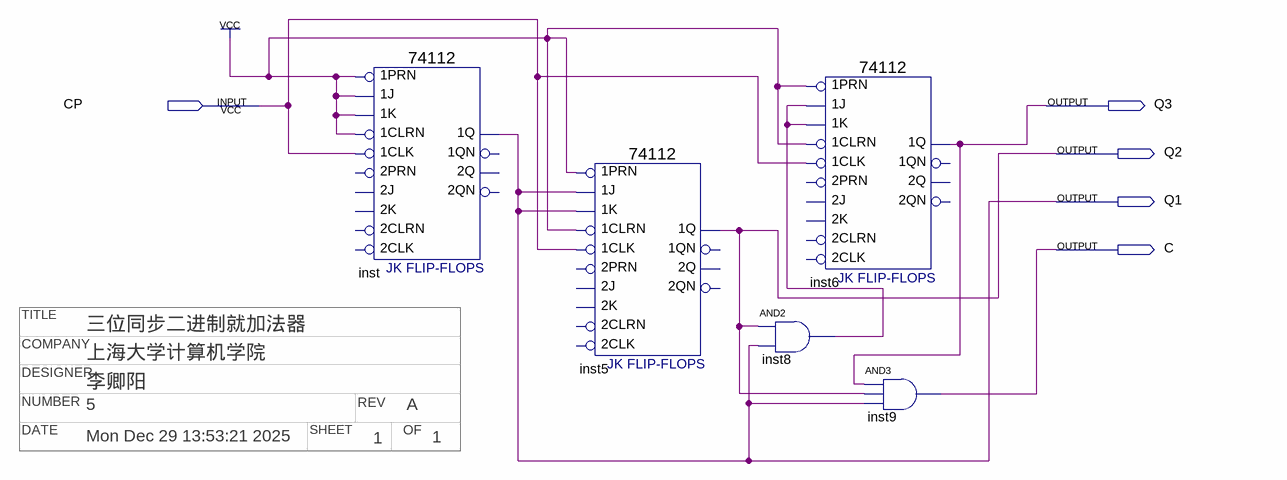
[diagram p0: schematic sheet]
// Quartus schematic sikao1.bdf as structural Verilog: 5 symbols, 5 pins
// Title block: TITLE: 三位同步二进制就加法器; COMPANY: 上海大学计算机学院; DESIGNER: 李卿阳; NUMBER: 5; REV: A; DATE: Mon Dec 29 13:53:21 2025; SHEET: 1; OF: 1
module sikao1 (
  input  CP,
  output Q3,
  output Q2,
  output Q1,
  output C
);

  wire inst8_out;

  \74112  inst (
    .\1K (1'b1), .\1J (1'b1), .\1PRN (1'b1), .\1CLK (CP), .\1CLRN (1'b1), .\1Q (Q1));  // open: 2K, 2J, 2PRN, 2CLK, 2CLRN, 1QN, 2Q, 2QN
  \74112  inst5 (
    .\1K (Q1), .\1J (Q1), .\1PRN (1'b1), .\1CLK (CP), .\1CLRN (1'b1), .\1Q (Q2));  // open: 2K, 2J, 2PRN, 2CLK, 2CLRN, 1QN, 2Q, 2QN
  and inst8 (inst8_out, Q2, Q1);
  \74112  inst6 (
    .\1K (inst8_out), .\1J (inst8_out), .\1PRN (1'b1), .\1CLK (CP), .\1CLRN (1'b1), .\1Q (Q3));  // open: 2K, 2J, 2PRN, 2CLK, 2CLRN, 1QN, 2Q, 2QN
  and inst9 (C, Q3, Q2, Q1);
endmodule
